# EAGLE design MicroMod_STM32_Processor (EAGLE 9.6.2)
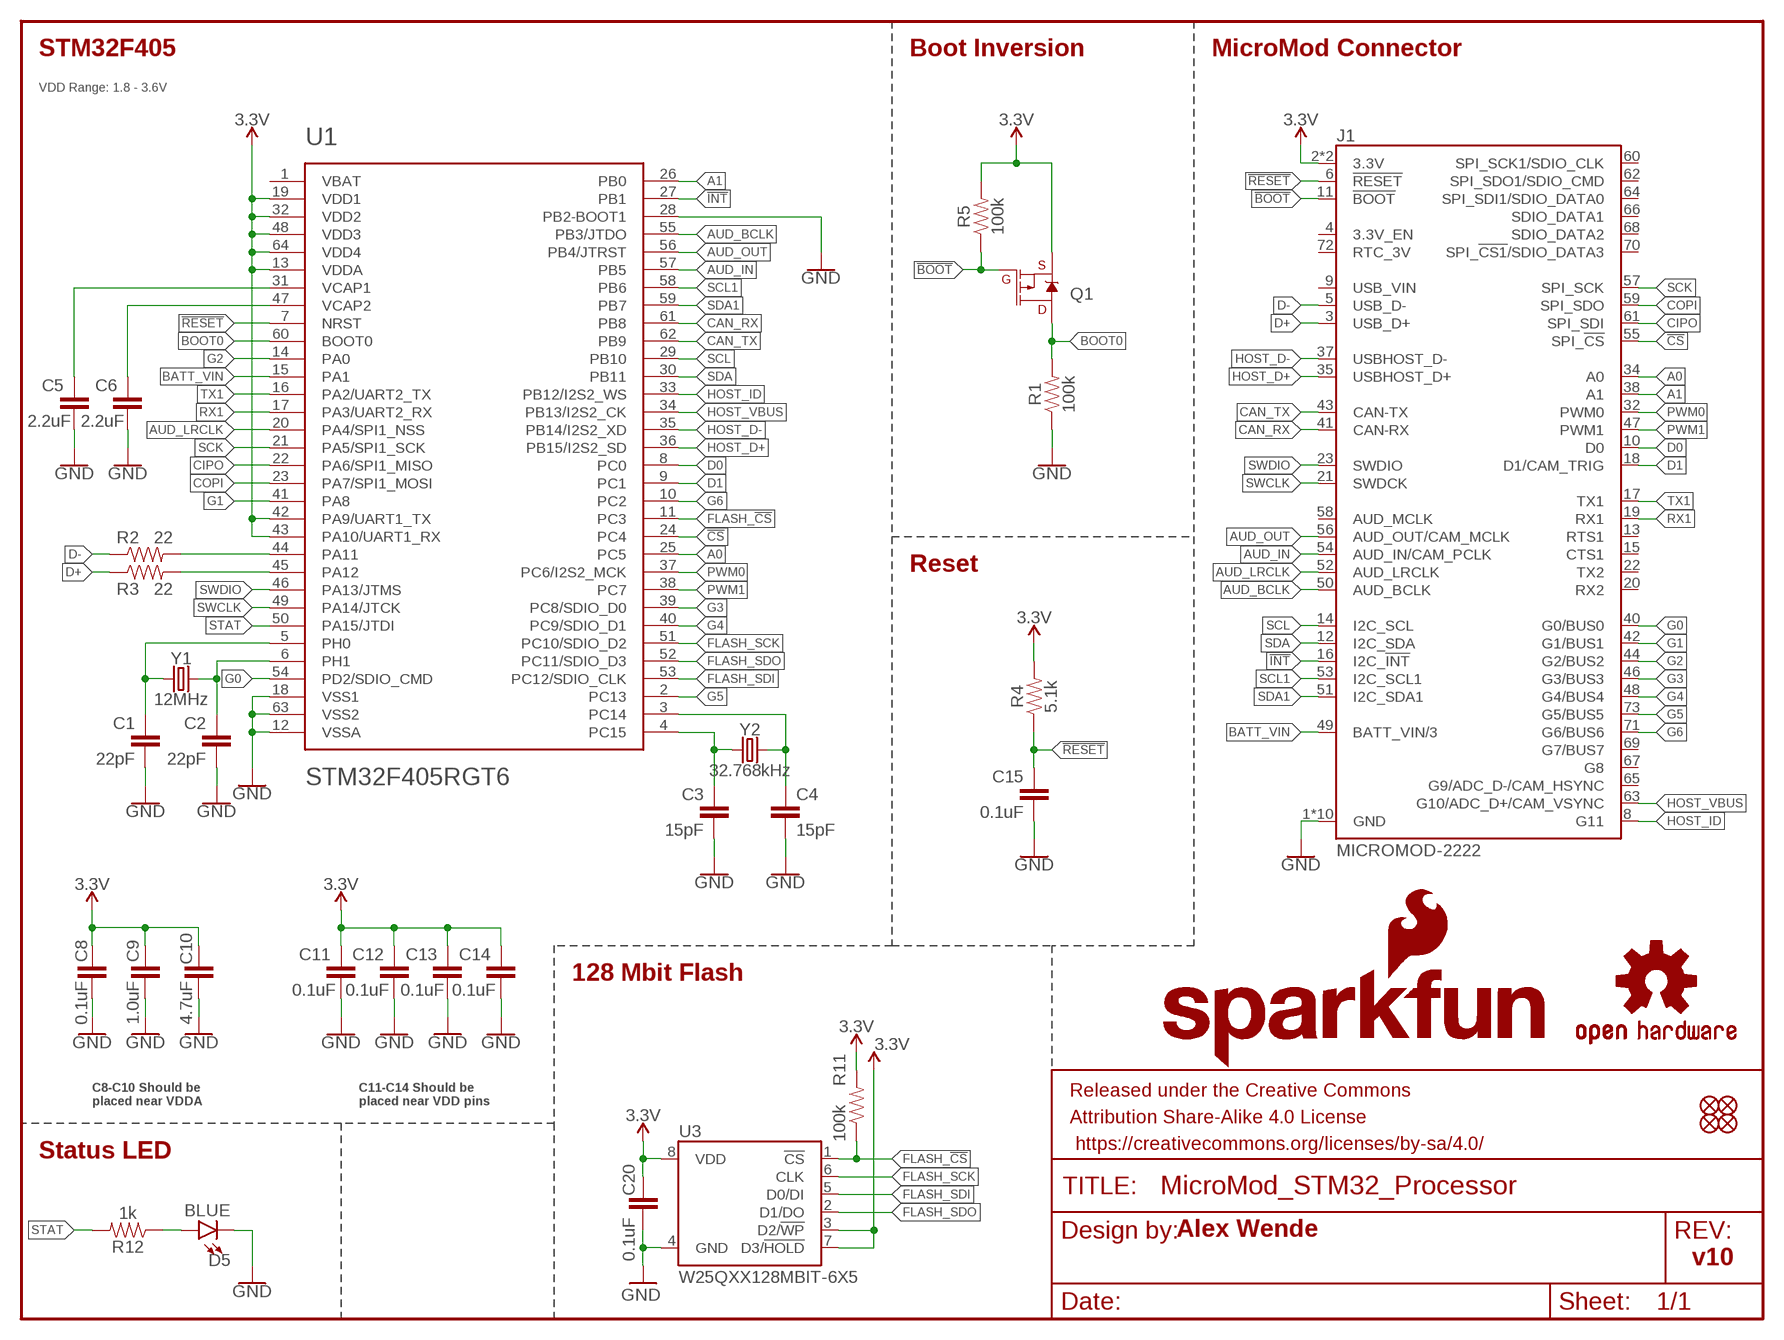
[diagram p0: schematic, sheet 1]

## Parts
C1  22pF  22PF-0402T-16V-10%  [0402-TIGHT]
C2  22pF  22PF-0402T-16V-10%  [0402-TIGHT]
C3  15pF  15PF-0402T-50V-5%  [0402-TIGHT]
C4  15pF  15PF-0402T-50V-5%  [0402-TIGHT]
C5  2.2uF  2.2UF-0402_TIGHT-10V-10%-X5R  [0402-TIGHT]
C6  2.2uF  2.2UF-0402_TIGHT-10V-10%-X5R  [0402-TIGHT]
C8  0.1uF  0.1UF-0402T-10V-10%-X7R  [0402-TIGHT]
C9  1.0uF  1.0UF-0402T-16V-10%  [0402-TIGHT]
C10  4.7uF  4.7UF-0402_TIGHT-6.3V-20%-X5R  [0402-TIGHT]
C11  0.1uF  0.1UF-0402T-10V-10%-X7R  [0402-TIGHT]
C12  0.1uF  0.1UF-0402T-10V-10%-X7R  [0402-TIGHT]
C13  0.1uF  0.1UF-0402T-10V-10%-X7R  [0402-TIGHT]
C14  0.1uF  0.1UF-0402T-10V-10%-X7R  [0402-TIGHT]
C15  0.1uF  0.1UF-0402T-10V-10%-X7R  [0402-TIGHT]
C20  0.1uF  0.1UF-0402T-10V-10%-X7R  [0402-TIGHT]
D5  BLUE  LED-BLUE0603  [LED-0603]
FD1  FIDUCIALUFIDUCIAL  [FIDUCIAL-MICRO]
FD2  FIDUCIALUFIDUCIAL  [FIDUCIAL-MICRO]
FD3  FIDUCIALUFIDUCIAL  [FIDUCIAL-MICRO]
FD4  FIDUCIALUFIDUCIAL  [FIDUCIAL-MICRO]
FRAME1  FRAME-LETTER  [CREATIVE_COMMONS]
J1  MICROMOD-2222  [M.2-CARD-E-22]
LOGO2  OSHW-LOGOS  [OSHW-LOGO-S]
LOGO3  SFE_LOGO_NAME_FLAME.1_INCH  [SFE_LOGO_NAME_FLAME_.1]
Q1  MOSFET_PCH-DMG2305UX-7  [SOT23-3]
R1  100k  100KOHM-0402T-1/16W-1%  [0402-TIGHT]
R2  22  22OHM-0402T-1/16W-1%  [0402-TIGHT]
R3  22  22OHM-0402T-1/16W-1%  [0402-TIGHT]
R4  5.1k  5.1KOHM-0402T-1/16W-1%  [0402-TIGHT]
R5  100k  100KOHM-0402T-1/16W-1%  [0402-TIGHT]
R11  100k  100KOHM-0402T-1/16W-1%  [0402-TIGHT]
R12  1k  1KOHM-0402T-1/16W-1%  [0402-TIGHT]
U1  STM32F405RGT6  STM32F405RG  [TQFP64]
U3  W25QXX128MBIT-6X5  [WSON-8-6X5]
Y1  12MHz  CRYSTAL-12MHZ"  [CRYSTAL-SMD-5X3.2-4PAD]
Y2  32.768kHz  CRYSTAL-32.768KHZSMD-3.2X1.5  [CRYSTAL-SMD-3.2X1.5MM]

## Nets
3.3V: C8.1 C9.1 C10.1 C11.1 C12.1 C13.1 C14.1 C20.1 J1.2(3.3V) J1.74(3.3V) Q1.2(S) R4.2 R5.2 R11.2 U1.13(VDDA) U1.19(VDD1) U1.32(VDD2) U1.42(PA9/UART1_TX) U1.43(PA10/UART1_RX) U1.48(VDD3) U1.64(VDD4) U3.3(D2/!WP!) U3.7(D3/!HOLD!) U3.8(VDD)
!BOOT: J1.11(!BOOT!) Q1.1(G) R5.1
!CS: J1.55(SPI_!CS!) U1.24(PC4)
!INT: J1.16(I2C_!INT!) U1.27(PB1)
!RESET: C15.1 J1.6(!RESET!) R4.1 U1.7(NRST)
A0: J1.34(A0) U1.25(PC5)
A1: J1.38(A1) U1.26(PB0)
AUD_BCLK: J1.50(AUD_BCLK) U1.55(PB3/JTDO)
AUD_IN: J1.54(AUD_IN/CAM_PCLK) U1.57(PB5)
AUD_LRCLK: J1.52(AUD_LRCLK) U1.20(PA4/SPI1_NSS)
AUD_OUT: J1.56(AUD_OUT/CAM_MCLK) U1.56(PB4/JTRST)
BATT_VIN: J1.49(BATT_VIN/3) U1.15(PA1)
BOOT0: Q1.3(D) R1.2 U1.60(BOOT0)
CAN_RX: J1.41(CAN-RX) U1.61(PB8)
CAN_TX: J1.43(CAN-TX) U1.62(PB9)
CIPO: J1.61(SPI_SDI) U1.22(PA6/SPI1_MISO)
COPI: J1.59(SPI_SDO) U1.23(PA7/SPI1_MOSI)
D0: J1.10(D0) U1.8(PC0)
D1: J1.18(D1/CAM_TRIG) U1.9(PC1)
D+: J1.3(USB_D+) R3.1
D-: J1.5(USB_D-) R2.1
FLASH_!CS: R11.1 U1.11(PC3) U3.1(!CS!)
FLASH_SCK: U1.51(PC10/SDIO_D2) U3.6(CLK)
FLASH_SDI: U1.53(PC12/SDIO_CLK) U3.5(D0/DI)
FLASH_SDO: U1.52(PC11/SDIO_D3) U3.2(D1/DO)
G0: J1.40(G0/BUS0) U1.54(PD2/SDIO_CMD)
G1: J1.42(G1/BUS1) U1.41(PA8)
G2: J1.44(G2/BUS2) U1.14(PA0)
G3: J1.46(G3/BUS3) U1.39(PC8/SDIO_D0)
G4: J1.48(G4/BUS4) U1.40(PC9/SDIO_D1)
G5: J1.73(G5/BUS5) U1.2(PC13)
G6: J1.71(G6/BUS6) U1.10(PC2)
GND: C1.2 C2.2 C3.2 C4.2 C5.2 C6.2 C8.2 C9.2 C10.2 C11.2 C12.2 C13.2 C14.2 C15.2 C20.2 D5.C J1.1(GND) J1.7(GND) J1.33(GND) J1.36(GND) J1.39(GND) J1.45(GND) J1.75(GND) J1.GND1(GND) J1.GND2(GND) J1.GND3(GND) R1.1 U1.12(VSSA) U1.18(VSS1) U1.28(PB2-BOOT1) U1.63(VSS2) U3.4(GND)
HOST_D+: J1.35(USBHOST_D+) U1.36(PB15/I2S2_SD)
HOST_D-: J1.37(USBHOST_D-) U1.35(PB14/I2S2_XD)
HOST_ID: J1.8(G11) U1.33(PB12/I2S2_WS)
HOST_VBUS: J1.63(G10/ADC_D+/CAM_VSYNC) U1.34(PB13/I2S2_CK)
N$1: D5.A R12.1
N$2: R2.2 U1.44(PA11)
N$3: R3.2 U1.45(PA12)
N$5: C4.1 U1.3(PC14) Y2.P$2
N$6: C3.1 U1.4(PC15) Y2.P$1
N$7: C2.1 U1.6(PH1) Y1.3
N$8: C1.1 U1.5(PH0) Y1.1
N$45: C6.1 U1.47(VCAP2)
N$46: C5.1 U1.31(VCAP1)
PWM0: J1.32(PWM0) U1.37(PC6/I2S2_MCK)
PWM1: J1.47(PWM1) U1.38(PC7)
RX1: J1.19(RX1) U1.17(PA3/UART2_RX)
SCK: J1.57(SPI_SCK) U1.21(PA5/SPI1_SCK)
SCL: J1.14(I2C_SCL) U1.29(PB10)
SCL1: J1.53(I2C_SCL1) U1.58(PB6)
SDA: J1.12(I2C_SDA) U1.30(PB11)
SDA1: J1.51(I2C_SDA1) U1.59(PB7)
STAT: R12.2 U1.50(PA15/JTDI)
SWCLK: J1.21(SWDCK) U1.49(PA14/JTCK)
SWDIO: J1.23(SWDIO) U1.46(PA13/JTMS)
TX1: J1.17(TX1) U1.16(PA2/UART2_TX)
Unconnected: J1.4(3.3V_EN) J1.9(USB_VIN) J1.13(RTS1) J1.15(CTS1) J1.20(RX2) J1.22(TX2) J1.58(AUD_MCLK) J1.60(SPI_SCK1/SDIO_CLK) J1.62(SPI_SDO1/SDIO_CMD) J1.64(SPI_SDI1/SDIO_DATA0) J1.65(G9/ADC_D-/CAM_HSYNC) J1.66(SDIO_DATA1) J1.67(G8) J1.68(SDIO_DATA2) J1.69(G7/BUS7) J1.70(SPI_!CS1!/SDIO_DATA3) J1.72(RTC_3V) U1.1(VBAT)

## Notes on the sheet
- STM32F405 | Boot Inversion | MicroMod Connector
- VDD Range: 1.8 - 3.6V
- Reset
- 128 Mbit Flash
- C8-C10 Should be 
  placed near VDDA
- C11-C14 Should be 
  placed near VDD pins
- Status LED
- Alex Wende
- v10

## Library data of the parts
C1 C2 = SparkFun-Capacitors:22PF: 22pF ceramic capacitors A capacitor is a passive two-terminal electrical component used to store electrical energy temporarily in an electric field.; PROD_ID: CAP-14674
C3 C4 = SparkFun-Capacitors:15PF: 15pF ceramic capacitors A capacitor is a passive two-terminal electrical component used to store electrical energy temporarily in an electric field.; PROD_ID: CAP-13063
C5 C6 = SparkFun-Capacitors:2.2UF: 2.2µF ceramic capacitors A capacitor is a passive two-terminal electrical component used to store electrical energy temporarily in an electric field.; PROD_ID: CAP-14232
C8 = SparkFun-Capacitors:0.1UF: 0.1µF ceramic capacitors A capacitor is a passive two-terminal electrical component used to store electrical energy temporarily in an electric field.; PROD_ID: CAP-15083; SPICEPREFIX: C
C9 = SparkFun-Capacitors:1.0UF: 1µF ceramic capacitors A capacitor is a passive two-terminal electrical component used to store electrical energy temporarily in an electric field.; PROD_ID: CAP-12417; SPICEPREFIX: C
C10 = SparkFun-Capacitors:4.7UF: 4.7µF ceramic capacitors A capacitor is a passive two-terminal electrical component used to store electrical energy temporarily in an electric field.; PROD_ID: CAP-14240; SPICEPREFIX: C
C11-C15 C20 = SparkFun-Capacitors:0.1UF: 0.1µF ceramic capacitors A capacitor is a passive two-terminal electrical component used to store electrical energy temporarily in an electric field.; PROD_ID: CAP-15083
D5 = SparkFun-LED:LED-BLUE: Blue SMD LED Used in manufacturing of various products at SparkFun Packages: 0603 - SMD 0603 package [Product Link] <http://www.digikey.com/product-detail/en/SMLE12BC7TT86/511-1589-2-ND/1641808> 1206 - SMD1206 package [Product Link] <http://www.digikey.com/product-detail/en/lite-on-inc/LTST-C150TBKT/160-1643-1-ND/573584> SparkFun Products: ESP8266 Thing-Dev Board <https://www.sparkfun.com/products/13711> RedBoard <https://www.sparkfun.com/products/12757>; PROD_ID: DIO-08575
FD1-FD4 = SparkFun-Aesthetics:FIDUCIAL: Fiducial Alignment Points Point-of-reference for pick-and-place machines and other optical instruments.
FRAME1 = SparkFun-Aesthetics:FRAME-LETTER: Schematic Frame - Letter Standard 8.5x11 US Letter frame
J1 = SparkFun-MicroMod:MICROMOD: MicroMod Connector Description: A card edge connector and mating PCB connector to allow various MicroMod Processor Boards to be coupled with various carrier boards of different capabilities. Based on the M.2 standard.
LOGO2 = SparkFun-Aesthetics:OSHW-LOGO: Open-Source Hardware (OSHW) Logo This logo indicates the piece of hardware it is found on incorporates a OSHW license and/or adheres to the definition of open source hardware found here: http://freedomdefined.org/OSHW
LOGO3 = SparkFun-Aesthetics:SFE_LOGO_NAME_FLAME: SparkFun Font Logo w/ Flame This is the SparkFun full logo. The logo on the schematic will always be the same size; the package variant is the height of the flame part of the logo. Default layer for the logo on the board is tSilk.
Q1 = SparkFun-DiscreteSemi:MOSFET_PCH: P-channel MOSFETs Voltage controlled devices that allow control of high current outputs. SparkFun Products: SparkFun ESP32 Thing <https://www.sparkfun.com/products/13907> SparkFun ESP8266 Thing <https://www.sparkfun.com/products/13231> SparkFun Pi Servo HAT V2 <https://www.sparkfun.com/products/15316> DMG2305UX-7 (20V/4.2A/SOT23-3); PROD_ID: TRAN-14388; VALUE: 20V/4.2A/52mΩ/1.4W
R1 R5 R11 = SparkFun-Resistors:100KOHM: 100kΩ resistor A resistor is a passive two-terminal electrical component that implements electrical resistance as a circuit element. Resistors act to reduce current flow, and, at the same time, act to lower voltage levels within circuits. - Wikipedia; PROD_ID: RES-13495
R2 R3 = SparkFun-Resistors:22OHM: 22Ω resistor A resistor is a passive two-terminal electrical component that implements electrical resistance as a circuit element. Resistors act to reduce current flow, and, at the same time, act to lower voltage levels within circuits. - Wikipedia; PROD_ID: RES-12427
R4 = SparkFun-Resistors:5.1KOHM; PROD_ID: RES-14340
R12 = SparkFun-Resistors:1KOHM: 1kΩ resistor A resistor is a passive two-terminal electrical component that implements electrical resistance as a circuit element. Resistors act to reduce current flow, and, at the same time, act to lower voltage levels within circuits. - Wikipedia; PROD_ID: RES-14342
U1 = STM32_Temp:STM32F405RG: STM32F405RGT6 ARM DSP Chip used on the WAV Trigger board. IC MCU 32BIT 1MB FLASH 64LQFP Datasheet <https://cdn.sparkfun.com/datasheets/Widgets/STM32F405RGT6.pdf> SparkFun Products WAV Trigger <https://www.sparkfun.com/products/13660> (WIG-13660); PROD_ID: IC-11709
U3 = SparkFun-MicroMod:W25QXX; PROD_ID: IC-15107
Y1 = SparkFun-Clocks:CRYSTAL-12MHZ: 12.0MHz Crystal Frequency: 12.0MHz Frequency Tolerance: ±20ppm Load Capacitance: 18pF SparkFun Products: SparkFun Logomatic <https://www.sparkfun.com/products/12772> Pocket AVR Programmer <https://www.sparkfun.com/products/9825>; PROD_ID: XTAL-08297
Y2 = SparkFun-Clocks:CRYSTAL-32.768KHZ: 32.768kHz Crystal Frequency: 32.768kHz Frequency Stability: ±20ppm Load Capacitance: 12.5pF (PTH-2X6 & SMD-3.2X1.5), 6pF (SMD-2X6) SparkFun Products: SparkFun BigTime Watch Kit <https://www.sparkfun.com/products/11734> SparkFun nRF52832 Breakout <https://www.sparkfun.com/products/13990> SparkFun Real Time Clock Module <https://www.sparkfun.com/products/12708>; PROD_ID: XTAL-13062

## Board
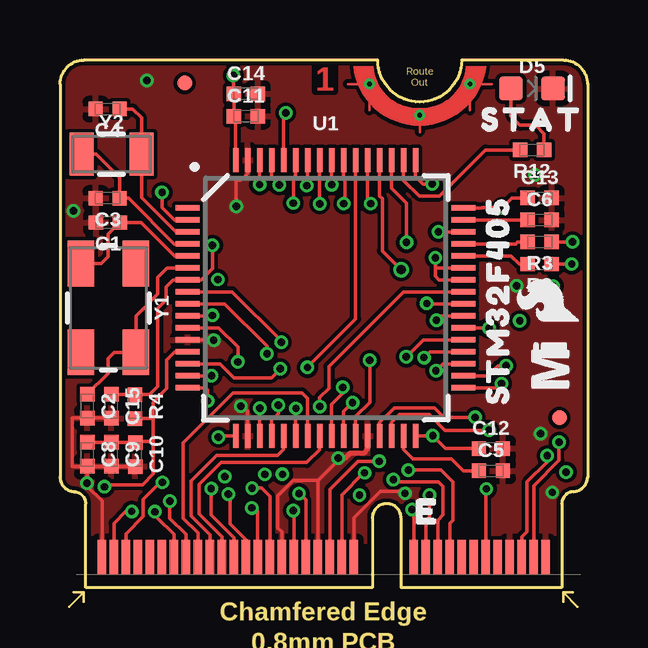
[diagram p1: board, top side]
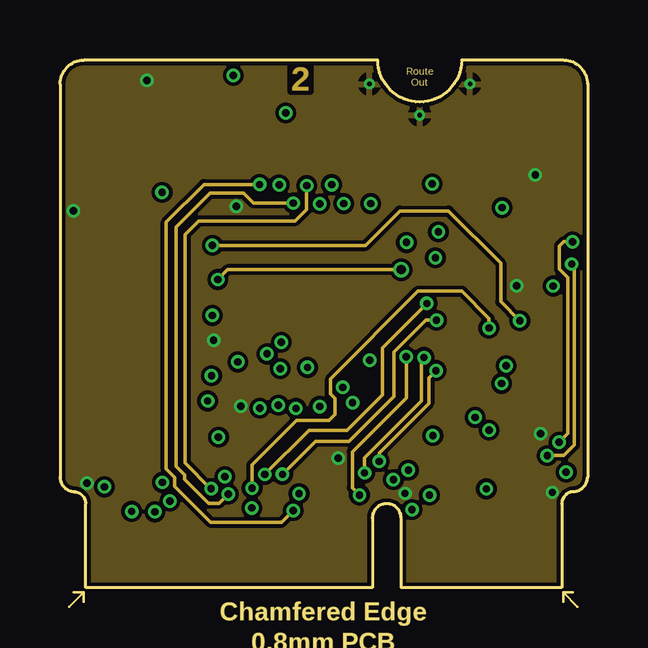
[diagram p2: board, inner layer Route2]
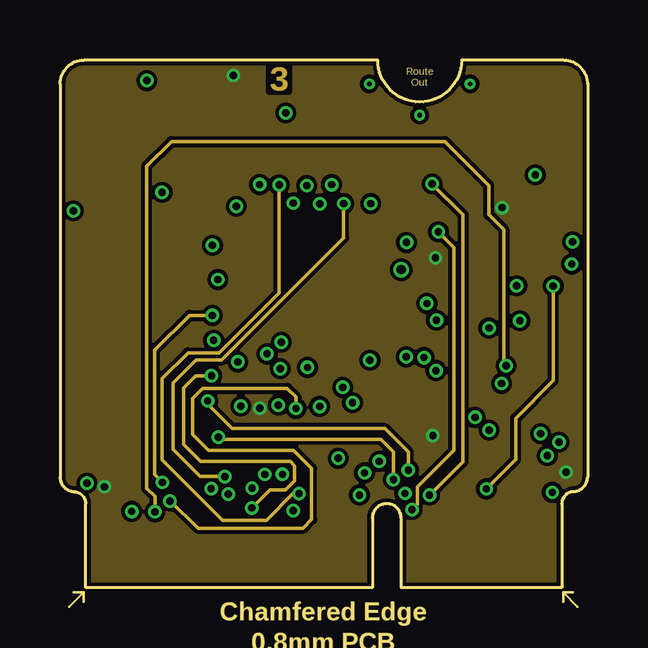
[diagram p3: board, inner layer Route15]
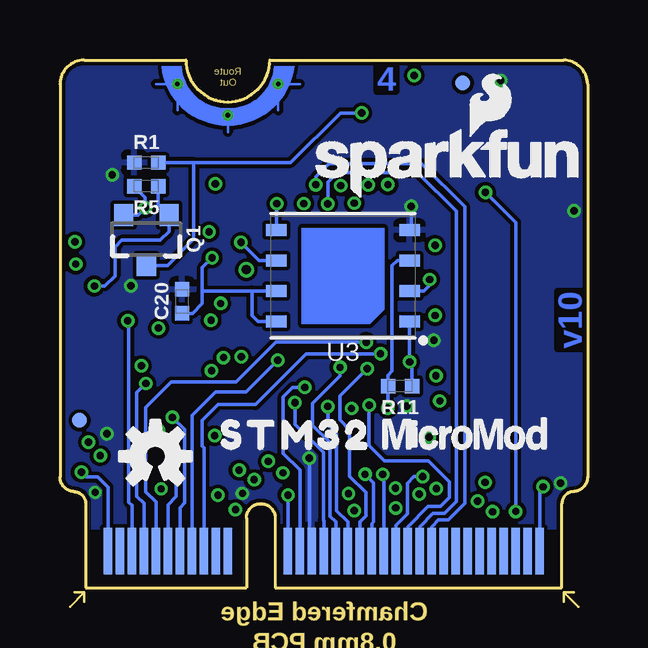
[diagram p4: board, bottom side, seen from below]

Size 22 x 22 mm. Coordinates in mm from the lower left corner, seen from the top.
Outline: 16.75,22 21,22 arc-87 22,21 22,4.6 arc-87 21.4,4 arc85 20.93,3.5 20.93,0 14.22,0 14.22,2.9 arc180 13.03,2.9 13.03,0 1.07,0 1.07,3.5 arc84 0.6,4 arc-87 0,4.6 0,21 arc-87 1,22 13.25,22
Outline: 16.75,22 arc-180 13.25,22
Outline: 16.75,22 arc-180 13.25,22
Copper layers (1*2*15*16): Top 0.035559375mm / dielectric 0.47751875mm / Route2 0.035559375mm / dielectric 0.47751875mm / Route15 0.035559375mm / dielectric 0.47751875mm / Bottom 0.035559375mm
Design rules "SparkFun-4-layer-FAB-LIMIT": minimum track width 4mil, minimum drill 6mil, track to track 5mil, track to pad 5mil, pad to pad 5mil, via to via 5mil, smd to smd 5mil, copper to edge 4mil, drill to drill 4mil, minimum pad ring 5mil, minimum via ring 5mil, stop-mask expansion 4mil, vias tented up to drill 25mil, thermal gap 10mil

### Footprints (pad centres in the part's own frame; a part is rotated, then mirrored left to right if it is on the bottom)
0402-TIGHT = smd 0.6 x 0.6: 1 -0.5,0; 2 0.5,0
LED-0603 = smd 1 x 1: A -0.877,0; C 0.877,0
FIDUCIAL-MICRO = smd 0.635 x 0.635: 1 0,0
M.2-CARD-E-22 = smd 0.35 x 1.45: 1 9.25,1.275; 3 8.75,1.275; 5 8.25,1.275; 7 7.75,1.275; 9 7.25,1.275; 11 6.75,1.275; 13 6.25,1.275; 15 5.75,1.275; 17 5.25,1.275; 19 4.75,1.275; 21 4.25,1.275; 23 3.75,1.275; 33 1.25,1.275; 35 0.75,1.275; 37 0.25,1.275; 39 -0.25,1.275; 41 -0.75,1.275; 43 -1.25,1.275; 45 -1.75,1.275; 47 -2.25,1.275; 49 -2.75,1.275; 51 -3.25,1.275; 53 -3.75,1.275; 55 -4.25,1.275; 57 -4.75,1.275; 59 -5.25,1.275; 61 -5.75,1.275; 63 -6.25,1.275; 65 -6.75,1.275; 67 -7.25,1.275; 69 -7.75,1.275; 71 -8.25,1.275; 73 -8.75,1.275; 75 -9.25,1.275 | smd 0.35 x 1.95 bottom: 2 9,1.525; 4 8.5,1.525; 6 8,1.525; 8 7.5,1.525; 10 7,1.525; 12 6.5,1.525; 14 6,1.525; 16 5.5,1.525; 18 5,1.525; 20 4.5,1.525; 22 4,1.525; 32 1.5,1.525; 34 1,1.525; 36 0.5,1.525; 38 0,1.525; 40 -0.5,1.525; 42 -1,1.525; 44 -1.5,1.525; 46 -2,1.525; 48 -2.5,1.525; 50 -3,1.525; 52 -3.5,1.525; 54 -4,1.525; 56 -4.5,1.525; 58 -5,1.525; 60 -5.5,1.525; 62 -6,1.525; 64 -6.5,1.525; 66 -7,1.525; 68 -7.5,1.525; 70 -8,1.525; 72 -8.5,1.525; 74 -9,1.525 | drill 0.2: GND1 1.9,21; GND2 4,19.7; GND3 6.1,21
SOT23-3 = smd 0.8 x 0.9: 1 -0.95,-1; 2 0.95,-1; 3 0,1.1
TQFP64 = smd 0.22 x 1: 1 -3.75,-5.75; 2 -3.25,-5.75; 3 -2.75,-5.75; 4 -2.25,-5.75; 5 -1.75,-5.75; 6 -1.25,-5.75; 7 -0.75,-5.75; 8 -0.25,-5.75; 9 0.25,-5.75; 10 0.75,-5.75; 11 1.25,-5.75; 12 1.75,-5.75; 13 2.25,-5.75; 14 2.75,-5.75; 15 3.25,-5.75; 16 3.75,-5.75; 33 3.75,5.75; 34 3.25,5.75; 35 2.75,5.75; 36 2.25,5.75; 37 1.75,5.75; 38 1.25,5.75; 39 0.75,5.75; 40 0.25,5.75; 41 -0.25,5.75; 42 -0.75,5.75; 43 -1.25,5.75; 44 -1.75,5.75; 45 -2.25,5.75; 46 -2.75,5.75; 47 -3.25,5.75; 48 -3.75,5.75 | smd 1 x 0.22: 17 5.75,-3.75; 18 5.75,-3.25; 19 5.75,-2.75; 20 5.75,-2.25; 21 5.75,-1.75; 22 5.75,-1.25; 23 5.75,-0.75; 24 5.75,-0.25; 25 5.75,0.25; 26 5.75,0.75; 27 5.75,1.25; 28 5.75,1.75; 29 5.75,2.25; 30 5.75,2.75; 31 5.75,3.25; 32 5.75,3.75; 49 -5.75,3.75; 50 -5.75,3.25; 51 -5.75,2.75; 52 -5.75,2.25; 53 -5.75,1.75; 54 -5.75,1.25; 55 -5.75,0.75; 56 -5.75,0.25; 57 -5.75,-0.25; 58 -5.75,-0.75; 59 -5.75,-1.25; 60 -5.75,-1.75; 61 -5.75,-2.25; 62 -5.75,-2.75; 63 -5.75,-3.25; 64 -5.75,-3.75
WSON-8-6X5 = smd 0.85 x 0.5: 1 -2.775,1.905; 2 -2.775,0.635; 3 -2.775,-0.635; 4 -2.775,-1.905; 5 2.775,-1.905; 6 2.775,-0.635; 7 2.775,0.635; 8 2.775,1.905
CRYSTAL-SMD-5X3.2-4PAD = smd 1.9 x 1.1: 1 -1.85,-1.15; 2 1.85,-1.15; 3 1.85,1.15; 4 -1.85,1.15
CRYSTAL-SMD-3.2X1.5MM = smd 1 x 1.8: P$1 -1.25,0; P$2 1.25,0

### Placement (x,y rotation side)
C1  2,15.22 180 top
C2  1.14,7.57 270 top
C3  1.99,16.23 180 top
C4  1.99,19.95 180 top
C5  17.97,4.87 0 top
C6  20,15.33 0 top
C8  1.14,5.56 270 top
C9  2.14,5.56 270 top
C10  3.14,5.55 270 top
C11  7.75,19.65 0 top
C12  17.97,5.8 0 top
C13  20,16.25 0 top
C14  7.75,20.59 0 top
C15  2.14,7.56 270 top
C20  16.91,11.93 90 bottom
D5  19.68,20.81 0 top
FD1  20.82,7.08 0 top
FD2  5.2,21.04 0 bottom
FD3  21.18,6.97 0 bottom
FD4  5.2,21.04 0 top
FRAME1  -15.01,-13.06 0 top  (outside the outline)
J1  11,0 0 top
LOGO2  18.02,5.47 0 bottom
LOGO3  5.78,17.71 0 bottom
Q1  18.4,14.53 180 bottom
R1  18.4,17.72 0 bottom
R2  20,13.49 180 top
R3  20,14.41 180 top
R4  3.13,7.55 270 top
R5  18.4,16.73 180 bottom
R11  7.82,8.4 180 bottom
R12  19.68,18.25 180 top
U1  11.08,12.08 270 top
U3  10.2,13 180 bottom
U$1  [STAT0]  19.68,19.51 0 top
U$2  [STM320]  12.16,6.36 0 bottom
U$3  [MICROMOD_MI_LOGO_.35]  20.42,9.23 90 top
U$4  [STM32F4050]  18.26,11.99 90 top
U$5  [MICROMOD_LOGO_.3]  5.16,6.36 0 bottom
U$6  [SFE_LOGO_FLAME_.1]  20.32,11.95 90 top
U$7  [PRODUCTION_INSTRUCTIONS]  37,49 0 top  (outside the outline)
Y1  2.02,11.66 270 top
Y2  2.15,18.07 0 top

### Tracks (layer width: path | path; a pad name or v marks a point on that pad's centre or on a via)
3.3V  (via drill 0.3)
  Top 0.152: 3.22,7.05 R4.2 3.88,7.05 | U1.48 17.58,15.83 17.59,15.84 v18.44,15.84 18.85,16.25 C13.1 | U1.19 v8.33,7.48 | U1.13 4.78,9.83 4.45,9.5 4.45,8.29 3.88,7.72 3.88,7.05 | C14.1 | v1.85,4.2 1.94,4.29 3.44,4.29 3.88,4.73 3.88,6.1 | v15.65,13.75 v15.66,13.75 | U1.42 15.81,12.83 15.66,12.98 15.66,13.33 | 15.66,13.33 v15.66,13.75 | v15.66,13.75 15.66,13.73 | C14.1 7.23,20.61 v7.23,21.35 | U1.32 v15.55,6.33 16.08,5.8 C12.1 | C14.1 C11.1 7.33,19.57 U1.64 | 3.24,6.05 C10.1 | C8.1 C9.1 C10.1 | 3.88,6.1 3.88,7.05 | C10.1 3.14,6.1 3.88,6.1 | U1.43 15.66,13.33
  Bottom 0.152: J1.74 2,4.05 v1.85,4.2 | J1.2 20,4.18 20.43,4.61 20.91,4.61 v21.11,4.81 | 16.07,12.37 14,12.37 | 14,12.37 U3.7 | v8.33,7.48 8.32,7.49 R11.2 8.32,8.85 8.15,9.02 8.15,13.42 7.93,13.63 U3.3 | R5.2 18.44,16.27 v18.44,15.84 18.75,15.53 Q1.2 | v15.66,13.75 16.07,13.33 16.07,12.37 | U3.8 13.74,11.1 14,11.35 14,12.37 | C20.1 16.47,11.43 16.07,11.83 16.07,12.37
  pour Route15 (isolate 0.152): 0,0 0,22 22,22 22,0
!BOOT  (via drill 0.3)
  Top 0.152: J1.11 17.75,4.08 v17.78,4.11
  Route15 0.152: v17.78,4.11 19,5.33 19,7.06 20.57,8.63 v20.57,12.57
  Bottom 0.152: R5.1 17.9,15.98 Q1.1 17.45,14.85 17.82,14.48 19.42,14.48 19.7,14.2 19.7,13 20.13,12.57 v20.57,12.57
!CS
  Top 0.152: U1.24 10.83,5.75 10.29,5.21 6.71,5.21 5.79,4.29 5.79,3.07 6.75,2.11 J1.55
!INT  (via drill 0.3)
  Top 0.152: U1.27 12.33,7.13 12.92,7.73 v12.92,9.48
  Bottom 0.152: J1.16 16.5,7.17 15.5,8.16 14.23,8.16 v12.92,9.48
!RESET  (via drill 0.3)
  Top 0.152: C15.1 R4.1 3.73,8.05 4.07,8.39 4.07,11.63 4.43,11.99 4.43,12.54 4.72,12.83 U1.7 5.88,12.83 6.36,13.31 v6.36,14.27
  Route2 0.152: v19.18,11.12 18.38,11.92 18.38,13.53 16.2,15.7 14.17,15.7 12.74,14.27 v6.36,14.27
  Bottom 0.152: v19.18,11.12 19.13,11.08 19.13,3.56 19,3.43 J1.6
A0  (via drill 0.3)
  Top 0.152: U1.25 11.33,7.63 11.79,8.09 v11.79,8.35
  Bottom 0.152: J1.34 12,4.91 12.69,5.59 12.69,7.95 12.29,8.35 v11.79,8.35
A1  (via drill 0.3)
  Top 0.152: v12.2,7.71 v12.19,7.71 11.83,7.35 U1.26
  Bottom 0.152: v12.2,7.71 12.2,6.81 11.02,5.63 11.02,2.81 11,2.79 J1.38
AUD_BCLK  (via drill 0.3)
  Top 0.152: U1.55 11.83,17.11 11.89,17.05 11.89,16.07 v11.83,16.01
  Route15 0.152: v11.83,16.01 11.83,14.58 6.73,9.48 5.67,9.48 4.72,8.54 4.72,5.76 5.85,4.63 6.52,4.63 | 6.52,4.63 | 6.52,4.63 v6.87,4.63
  Bottom 0.152: J1.50 8,2.59 7.51,3.08 7.51,4.35 7.23,4.63 v6.87,4.63
AUD_IN  (via drill 0.3)
  Top 0.152: v10.83,16 U1.57
  Bottom 0.152: J1.54 7,2.54 6.44,3.1 5.97,3.1 5.48,3.59 5.48,15.7 7.08,17.3 10.44,17.3 10.83,16.91 v10.83,16
AUD_LRCLK  (via drill 0.3)
  Top 0.152: v9.11,7.6 9.11,7.26 8.83,6.98 U1.20
  Bottom 0.152: J1.52 7.5,2.53 6.65,3.38 6.14,3.38 5.76,3.76 5.76,4.4 6.64,5.28 8.46,5.28 9.11,5.93 v9.11,7.6
AUD_OUT  (via drill 0.3)
  Top 0.152: v11.33,16.8 U1.56
  Bottom 0.152: J1.56 6.5,2.54 6.22,2.82 5.8,2.82 5.12,3.5 5.12,15.88 6.92,17.68 10.77,17.68 11.33,17.13 v11.33,16.8
BATT_VIN  (via drill 0.3)
  Top 0.152: J1.49 8.23,1.29 8.23,3.19 8.11,3.32 v8.01,3.32 | U1.15 v6.32,8.83
  Route15 0.152: v8.01,3.32 8.77,4.08 9.41,4.08 9.76,4.43 9.79,4.45 9.79,5.08 9.61,5.26 5.86,5.26 5.15,5.97 5.15,8.33 5.66,8.83 v6.32,8.83
BOOT0  (via drill 0.3)
  Top 0.152: v9.42,19.79 v9.41,19.79 9.33,19.71 U1.60
  Bottom 0.152: 16.42,17.72 16.42,14.53 17.52,13.43 Q1.3 | v9.42,19.79 10.31,19.79 12.38,17.72 16.42,17.72 | 16.42,17.72 R1.2
CAN_RX  (via drill 0.3)
  Top 0.152: v9.97,3.92 9.98,3.92 10.25,3.65 J1.41 | U1.61 8.83,17.1 v9.14,16.79
  Route15 0.152: v9.97,3.92 9.72,3.92 8.61,2.81 6.78,2.81 4.27,5.32 4.27,8.72 5.34,9.79 6.64,9.79 9.14,12.29 v9.14,16.79
CAN_TX  (via drill 0.3)
  Top 0.152: J1.43 9.75,3.19 v9.73,3.21 | U1.62 v8.33,16.81 v8.32,16.8
  Route2 0.152: v8.32,16.8 v8.32,16.81 6.01,16.81 4.43,15.23 4.43,4.95 4.78,4.6 4.78,4.22 6.28,2.72 9.24,2.72 v9.73,3.21
CIPO  (via drill 0.3)
  Top 0.152: U1.22 v9.83,7.47 v9.84,7.47 | v4.58,3.6 4.58,2.89 5.25,2.22 J1.61
  Route15 0.152: v4.58,3.6 4.62,3.6 5.75,2.47 10.13,2.47 10.5,2.84 10.5,4.96 9.74,5.72 6.19,5.72 5.53,6.38 5.53,7.89 5.95,8.31 9.47,8.31 9.84,7.94 v9.84,7.47
COPI
  Top 0.152: U1.23 10.33,7.88 10.09,8.12 7.21,8.12 5.13,6.04 5.13,2.9 5.75,2.27 J1.59
D0  (via drill 0.3)
  Top 0.152: v9.23,10.23 9.23,10.29 7.19,12.33 U1.8
  Bottom 0.152: J1.10 18,3.58 18.42,4 18.42,7.51 17.37,8.56 14.66,8.56 12.99,10.23 v9.23,10.23
D1  (via drill 0.3)
  Top 0.152: v8.63,9.74 8.63,10.07 6.87,11.83 U1.9
  Bottom 0.152: v8.63,9.74 11.73,9.74 13.85,7.63 15.41,7.63 16.07,6.97 16.07,5.9 16,5.83 J1.18
D+  (via drill 0.3)
  Top 0.152: J1.3 19.75,4.24 20.81,5.3 v20.81,6.06 | v21.38,14.42 v21.37,14.41 R3.1
  Route2 0.152: v20.81,6.06 21.18,6.43 21.18,12.93 20.83,13.28 20.83,14.24 21.01,14.42 v21.38,14.42
D-  (via drill 0.3)
  Top 0.152: J1.5 19.25,2.1 19.47,2.33 19.47,4.4 20.32,5.25 v20.32,5.5 | v21.34,13.49 R2.1
  Route2 0.152: v20.32,5.5 21.02,5.5 21.46,5.94 21.46,13.37 v21.34,13.49
FLASH_!CS  (via drill 0.3)
  Top 0.152: U1.11 6.62,10.83 7.42,10.03 v7.42,9.41
  Bottom 0.152: R11.1 7.32,9.31 v7.42,9.41 U3.1
FLASH_SCK  (via drill 0.3)
  Top 0.152: U1.51 13.83,16.66 14.45,16.04 v14.45,14.39
  Bottom 0.152: v14.45,14.39 13.7,13.63 U3.6
FLASH_SDI  (via drill 0.3)
  Top 0.152: v12.96,16.01 12.83,16.14 U1.53
  Bottom 0.152: U3.5 12.97,15.99 v12.96,16.01
FLASH_SDO  (via drill 0.3, 0.38)
  Top 0.152: U1.52 13.33,16.32 13.44,16.21 13.44,14.04 v14.23,13.25
  Route2 0.152: v14.23,13.25 7,13.25 v6.59,12.84
  Bottom 0.152: U3.2 6.82,12.37 6.59,12.59 v6.59,12.84
G0  (via drill 0.3)
  Top 0.152: v10.32,9.18 v10.32,9.19 12.33,11.2 U1.54
  Bottom 0.152: J1.40 10.5,2.73 10.74,2.98 10.74,6.05 11.46,6.77 11.46,7.68 10.32,8.82 v10.32,9.18
G1  (via drill 0.3)
  Top 0.152: v10.83,7.55 10.83,7.93 11.21,8.31 11.21,9.21 14.33,12.33 U1.41
  Bottom 0.152: J1.42 10,2.74 10.46,3.2 10.46,6.42 10.83,6.78 v10.83,7.55
G2  (via drill 0.3)
  Top 0.152: U1.14 6.67,9.33 7.25,8.75 8.82,8.75 v9.19,9.12
  Bottom 0.152: J1.44 9.5,2.73 9.24,3 9.24,3.96 9.93,4.64 9.93,6.58 10.32,6.98 10.32,7.99 v9.19,9.12
G3  (via drill 0.3)
  Top 0.152: U1.39 15.88,11.33 v15.7,11.15
  Route2 0.152: v9.28,4.72 10.66,6.1 12.06,6.1 13.93,7.97 13.93,9.83 15.25,11.15 v15.7,11.15
  Bottom 0.152: v9.28,4.72 8.92,4.36 8.92,2.73 9,2.65 J1.46
G4  (via drill 0.3)
  Top 0.152: U1.40 15.32,11.83 v15.3,11.85
  Route2 0.152: v8.54,4.72 10.38,6.56 11.97,6.56 13.45,8.04 13.45,9.99 v15.3,11.84 v15.3,11.85
  Bottom 0.152: v8.54,4.72 8.5,4.68 J1.48
G5  (via drill 0.3)
  Top 0.152: v2.99,3.17 2.74,3.17 2.25,2.68 J1.73 | U1.2 4.78,15.33 4.26,15.85 v4.26,16.48
  Bottom 0.152: v2.99,3.17 2.99,15.22 v4.26,16.48
G6  (via drill 0.3)
  Top 0.152: v4.28,4.39 4.18,4.39 3.48,3.69 3.48,2.97 2.75,2.24 J1.71 | U1.10 6.33,11.33 v6.35,11.35
  Route15 0.152: v4.28,4.39 3.95,4.72 3.95,9.9 5.4,11.35 v6.35,11.35
GND  (via drill 0.3)
  Top 0.152: J1.75 1.75,3.61 1.14,4.22 C8.2 | C10.2 C9.2 C8.2 | C15.2 C2.2 0.51,7.07 0.51,5.06 C8.2 | J1.33 12.25,2.9 13.36,4.01 14.31,4.01 v14.39,3.93 | U1.18 7.83,7.36 7.63,7.56 v7.54,7.56 | J1.45 9.25,2.31 9.08,2.48 9.08,3.83 9.71,4.46 10.76,4.46 | v11.6,5.39 11.6,5.3 10.76,4.46 | J1.39 10.75,4.45 10.76,4.46 | U1.63 7.83,17.27 7.54,16.98 7.35,16.98 v7.35,15.9 | U1.12 5.94,10.33 5.96,10.31 v6.41,10.31
  Top 0.2: v11.6,5.39 11.89,5.39 12.1,5.6 12.66,5.6 12.83,5.77 U1.28
  Bottom 0.152: v11.6,5.39 11.6,1.62 J1.36 | U3.4 7.35,14.9 v7.35,15.9
  other vias: 20.53,3.97 20.04,6.42 1.12,4.35 19.82,17.21 19.05,12.58 0.56,15.71 3.63,21.14
  pour Route2 (isolate 0.152): 0,0 0,22 22,22 22,0
  pour Top (isolate 0.152): 0,1.89 0,22 22,22 22,1.89
  pour Bottom (isolate 0.152): 0,2.49 0,22 22,22 22,2.49
HOST_D+  (via drill 0.3)
  Top 0.152: J1.35 11.75,3.87 12.66,4.78 v12.7,4.78 | v15.18,9.59 15.42,9.83 U1.36
  Route2 0.152: v15.18,9.59 15.08,9.49 15.08,7.79 12.7,5.41 v12.7,4.78
HOST_D-  (via drill 0.3)
  Top 0.152: J1.37 11.25,4.08 12.43,5.26 v13.31,5.26 | v15.68,9.05 15.96,9.33 U1.35
  Route2 0.152: v13.31,5.26 13.31,5.61 15.38,7.68 15.38,8.75 v15.68,9.05
HOST_ID  (via drill 0.3)
  Top 0.152: v18.41,8.51 18.24,8.33 U1.33
  Bottom 0.152: J1.8 18.5,3.51 18.8,3.81 18.8,8.13 v18.41,8.51
HOST_VBUS  (via drill 0.3)
  Top 0.152: J1.63 4.75,2.21 4.05,2.91 4.05,3.16 v3.96,3.16 | v18.6,9.25 18.25,9.25 17.83,8.83 U1.34
  Route15 0.152: v3.96,3.16 3.96,3.79 3.62,4.13 3.62,17.57 4.65,18.6 16.05,18.6 17.88,16.77 17.88,15.55 18.5,14.93 18.5,9.35 v18.6,9.25
N$1
  Top 0.152: D5.A 18.8,19.66 19.18,19.28 19.84,19.28 20.18,18.94 R12.1
N$2
  Top 0.152: U1.44 18.81,13.83 19.15,13.49 R2.2
N$3
  Top 0.152: U1.45 19,14.33 19.08,14.41 R3.2
N$5
  Top 0.152: U1.3 4.84,14.83 3.4,16.27 Y2.P$2 3.4,19.59 3.03,19.95 C4.1
N$6
  Top 0.152: U1.4 4.77,14.33 2.87,16.23 C3.1 2.49,17.1 1.52,18.07 Y2.P$1
N$7
  Top 0.152: C2.1 2,8.93 2,9.55 2.26,9.81 Y1.3 3.17,11.33 4.07,12.23 4.07,12.93 4.47,13.33 U1.6
N$8
  Top 0.152: U1.5 4.78,13.83 3.39,15.22 C1.1 2.02,14.74 2.02,13.81 1.72,13.51 Y1.1
N$45
  Top 0.152: U1.47 C6.1
N$46
  Top 0.152: U1.31 14.33,5.76 14.72,5.37 16.32,5.37 16.82,4.87 C5.1
PWM0  (via drill 0.3)
  Top 0.152: U1.37 15.15,10.33 v14.44,9.62
  Route2 0.152: v14.44,9.62 14.44,7.91 12.19,5.66 12.19,4.16 v12.49,3.86
  Bottom 0.152: v12.49,3.86 12.49,1.53 J1.32
PWM1  (via drill 0.3)
  Top 0.152: J1.47 8.75,3.81 8.41,4.15 v8.01,4.15 | U1.38 v17.89,10.83 v17.89,10.82
  Route2 0.152: v8.01,4.15 8.01,5.11 9.86,6.96 11.21,6.96 11.46,7.21 11.46,7.89 11.28,8.07 11.28,8.71 14.93,12.36 16.76,12.36 17.89,11.23 v17.89,10.82
RX1  (via drill 0.3)
  Top 0.152: J1.19 15.75,2.81 15.97,3.03 15.97,4.23 15.79,4.41 13.99,4.41 v13.9,4.5 | U1.17 6.67,6.33 v6.61,6.27
  Route15 0.152: v13.9,4.5 13.9,5.66 13.39,6.17 6.71,6.17 v6.61,6.27
SCK
  Top 0.152: U1.21 9.33,5.77 9.07,5.51 6.53,5.51 5.46,4.44 5.46,2.98 6.25,2.19 J1.57
SCL  (via drill 0.3)
  Top 0.152: v17.31,7.1 16.01,7.1 15.61,7.5 13.95,7.5 13.33,6.88 U1.29
  Bottom 0.152: v17.31,7.1 16.8,6.58 16.8,3.52 17,3.33 J1.14
SCL1  (via drill 0.3)
  Top 0.152: J1.53 7.25,2.08 6.3,3.02 v6.3,4.12 | U1.58 10.33,16.8 v10.29,16.76
  Route2 0.152: v10.29,16.76 10.29,15.77 9.8,15.28 5.78,15.28 5.22,14.72 5.22,5.19 6.29,4.12 v6.3,4.12
SDA  (via drill 0.3)
  Top 0.152: v17.9,6.56 16.05,6.56 15.4,7.21 14.15,7.21 13.83,6.89 U1.30
  Bottom 0.152: v17.9,6.56 17.15,5.81 17.15,3.8 17.5,3.44 J1.12
SDA1  (via drill 0.3)
  Top 0.152: J1.51 7.75,2 7.09,2.66 7.09,3.83 v7.02,3.9 | U1.59 9.83,17.19 9.73,17.09 v9.73,16.03
  Route2 0.152: v9.73,16.03 8.08,16.03 7.66,16.45 6.25,16.45 4.84,15.04 4.84,5.06 5.2,4.7 5.2,4.51 6.2,3.51 6.63,3.51 v7.02,3.9
STAT
  Top 0.152: U1.50 14.33,16.98 14.98,16.33 15.82,16.33 17.74,18.25 R12.2
SWCLK  (via drill 0.3)
  Top 0.152: v15.41,3.85 15.41,2.95 15.25,2.79 J1.21 | U1.49 14.83,17.13 15.13,16.83 v15.52,16.83
  Route15 0.152: v15.52,16.83 16.8,15.54 16.8,5.25 v15.41,3.85
SWDIO  (via drill 0.3)
  Top 0.152: J1.23 14.75,3.25 v14.68,3.25 | U1.46 v15.78,14.83
  Route15 0.152: v15.78,14.83 16.43,14.19 16.43,5.72 14.9,4.2 14.9,3.47 v14.68,3.25
TX1  (via drill 0.3)
  Top 0.152: J1.17 16.25,2.67 16.38,2.8 16.38,4.41 15.88,4.9 v14.53,4.9 | U1.16 6.07,8.33 6.16,8.24 v6.16,7.78
  Route15 0.152: v14.53,4.9 14.53,5.65 13.55,6.63 7.18,6.63 6.16,7.65 v6.16,7.78

### Text on the board
Top: 1
Route2: 2
Route15: 3
Bottom: 4 | v10
tDocu: 0.8mm PCB / ENIG finish / 45 degree chamfered edge / Four layer design | Alex Wende